# EAGLE schematic Grove Beginner Kit for Arduino (EAGLE 9.5.2)
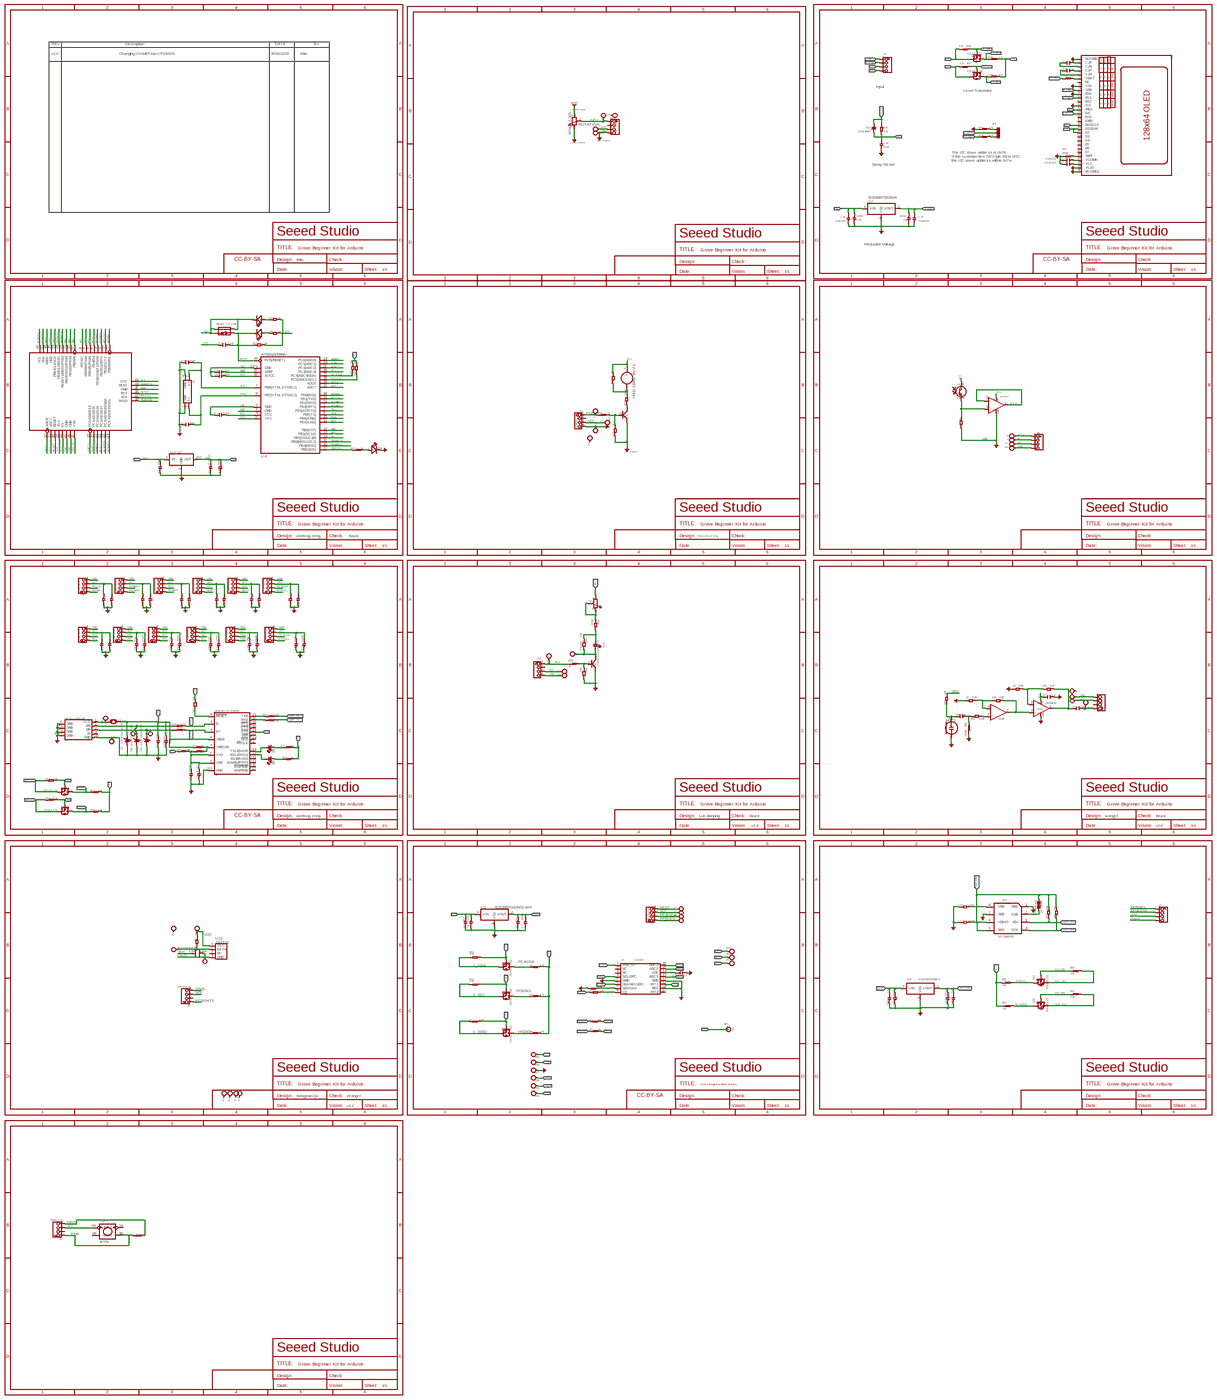
[diagram p0: schematic, sheet 1, overview]
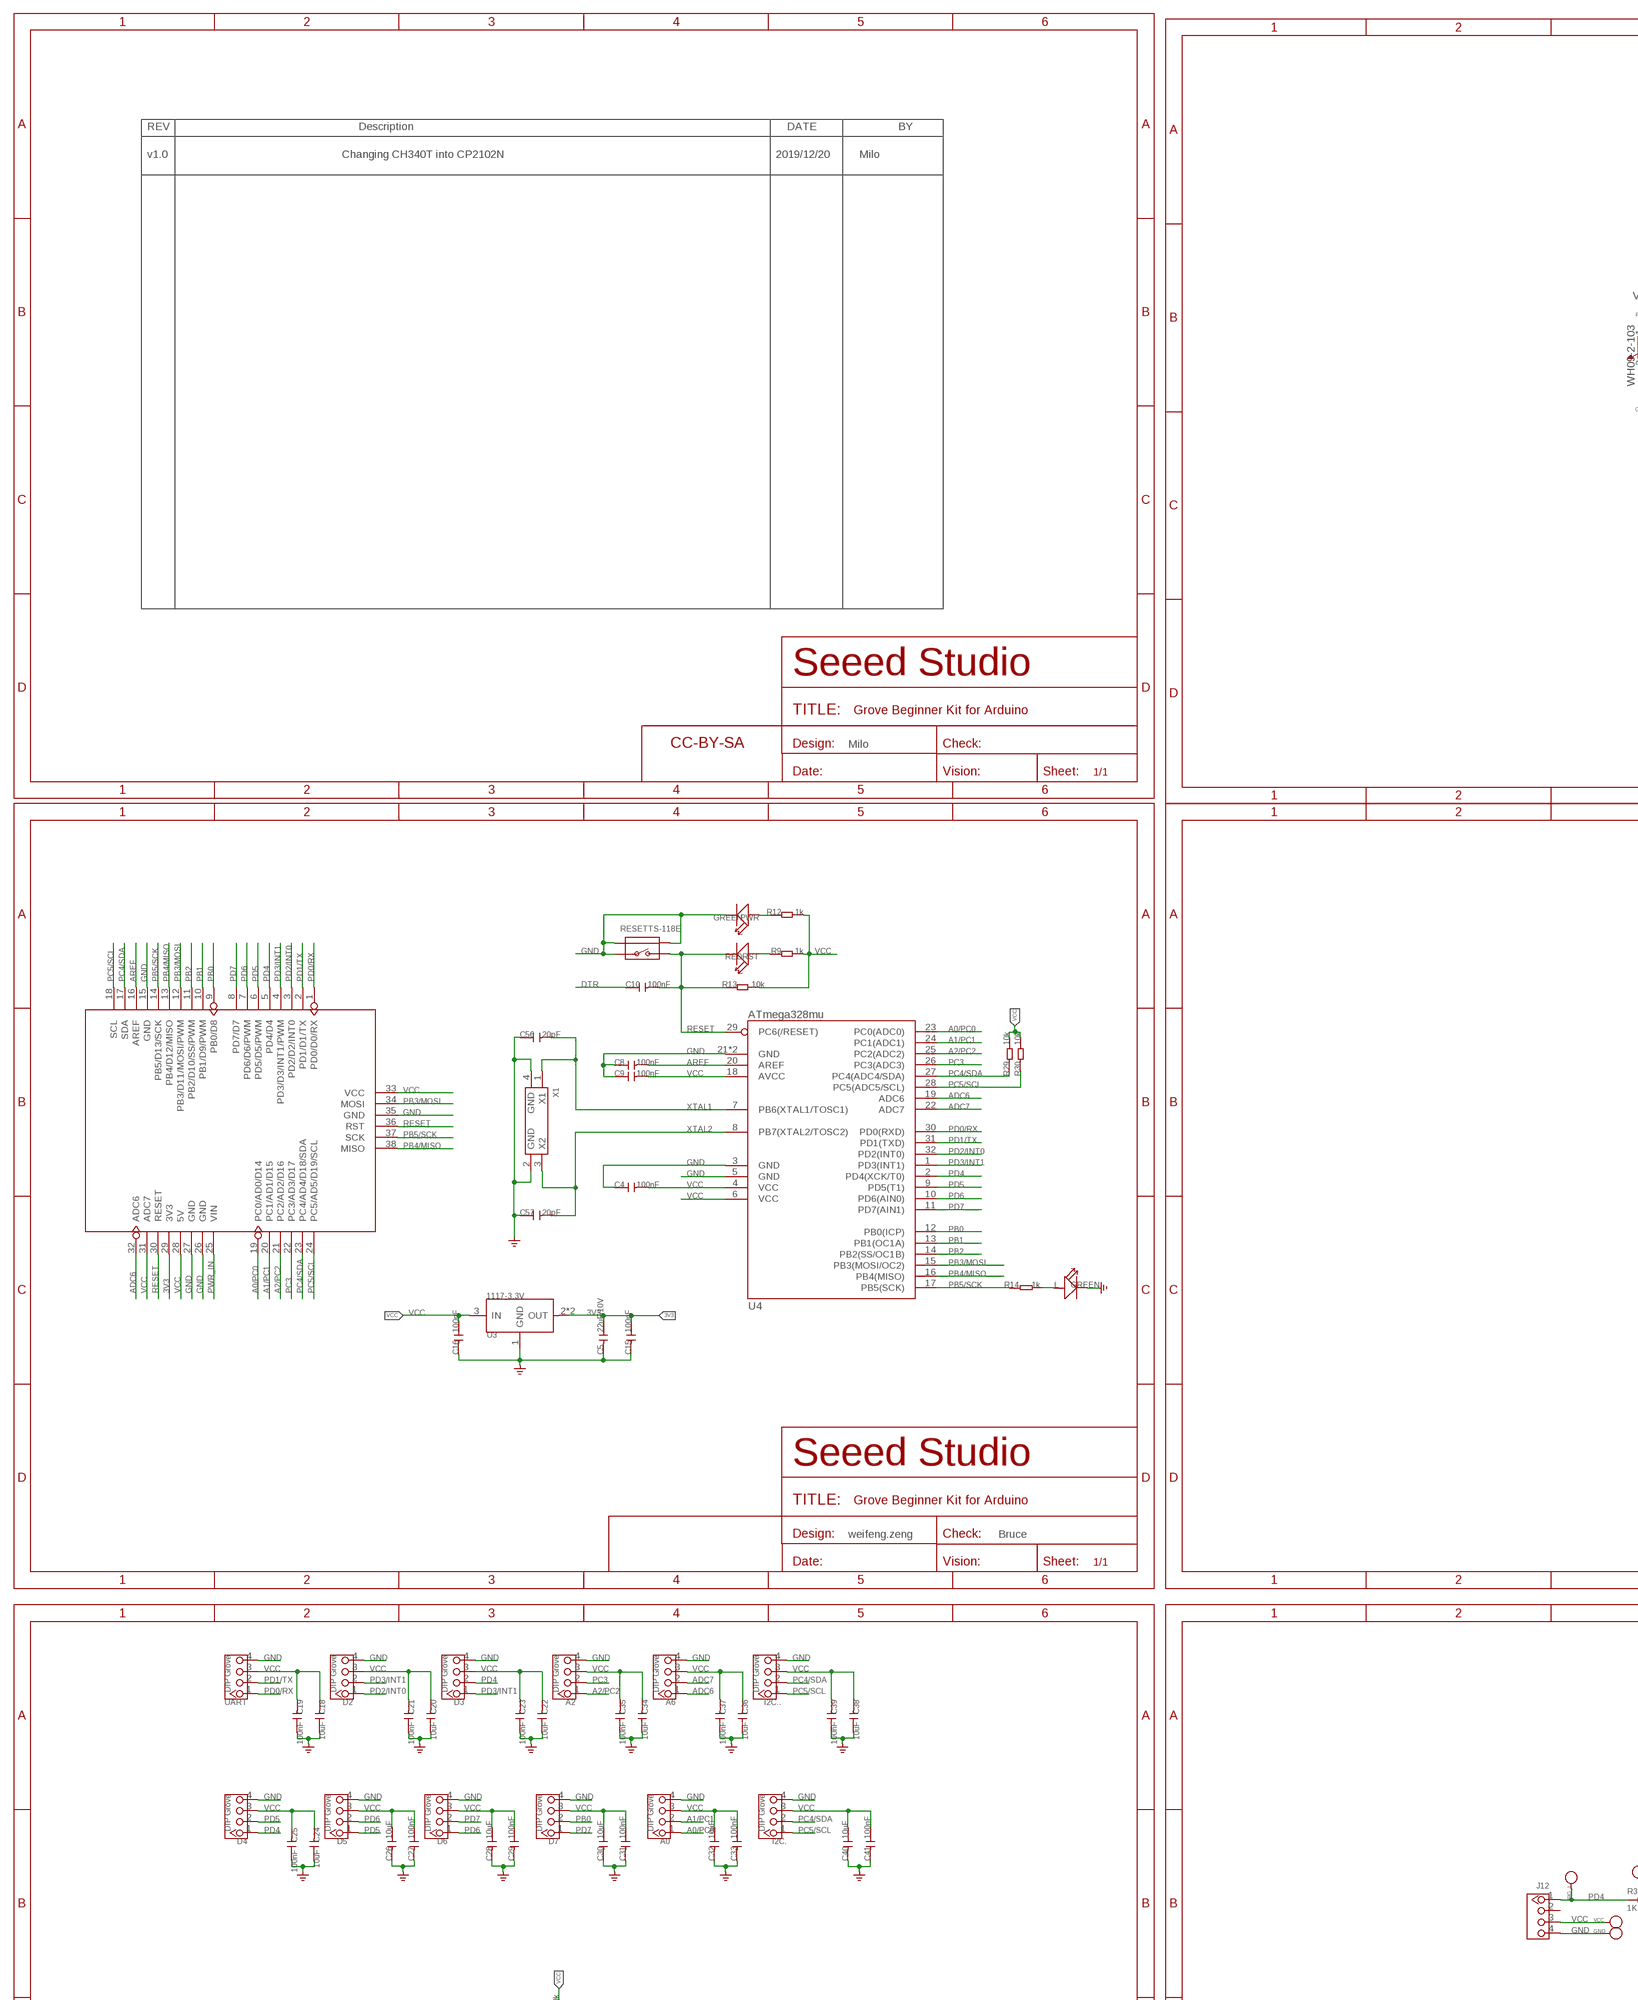
[diagram p1: schematic, sheet 1, part 1 of 4]
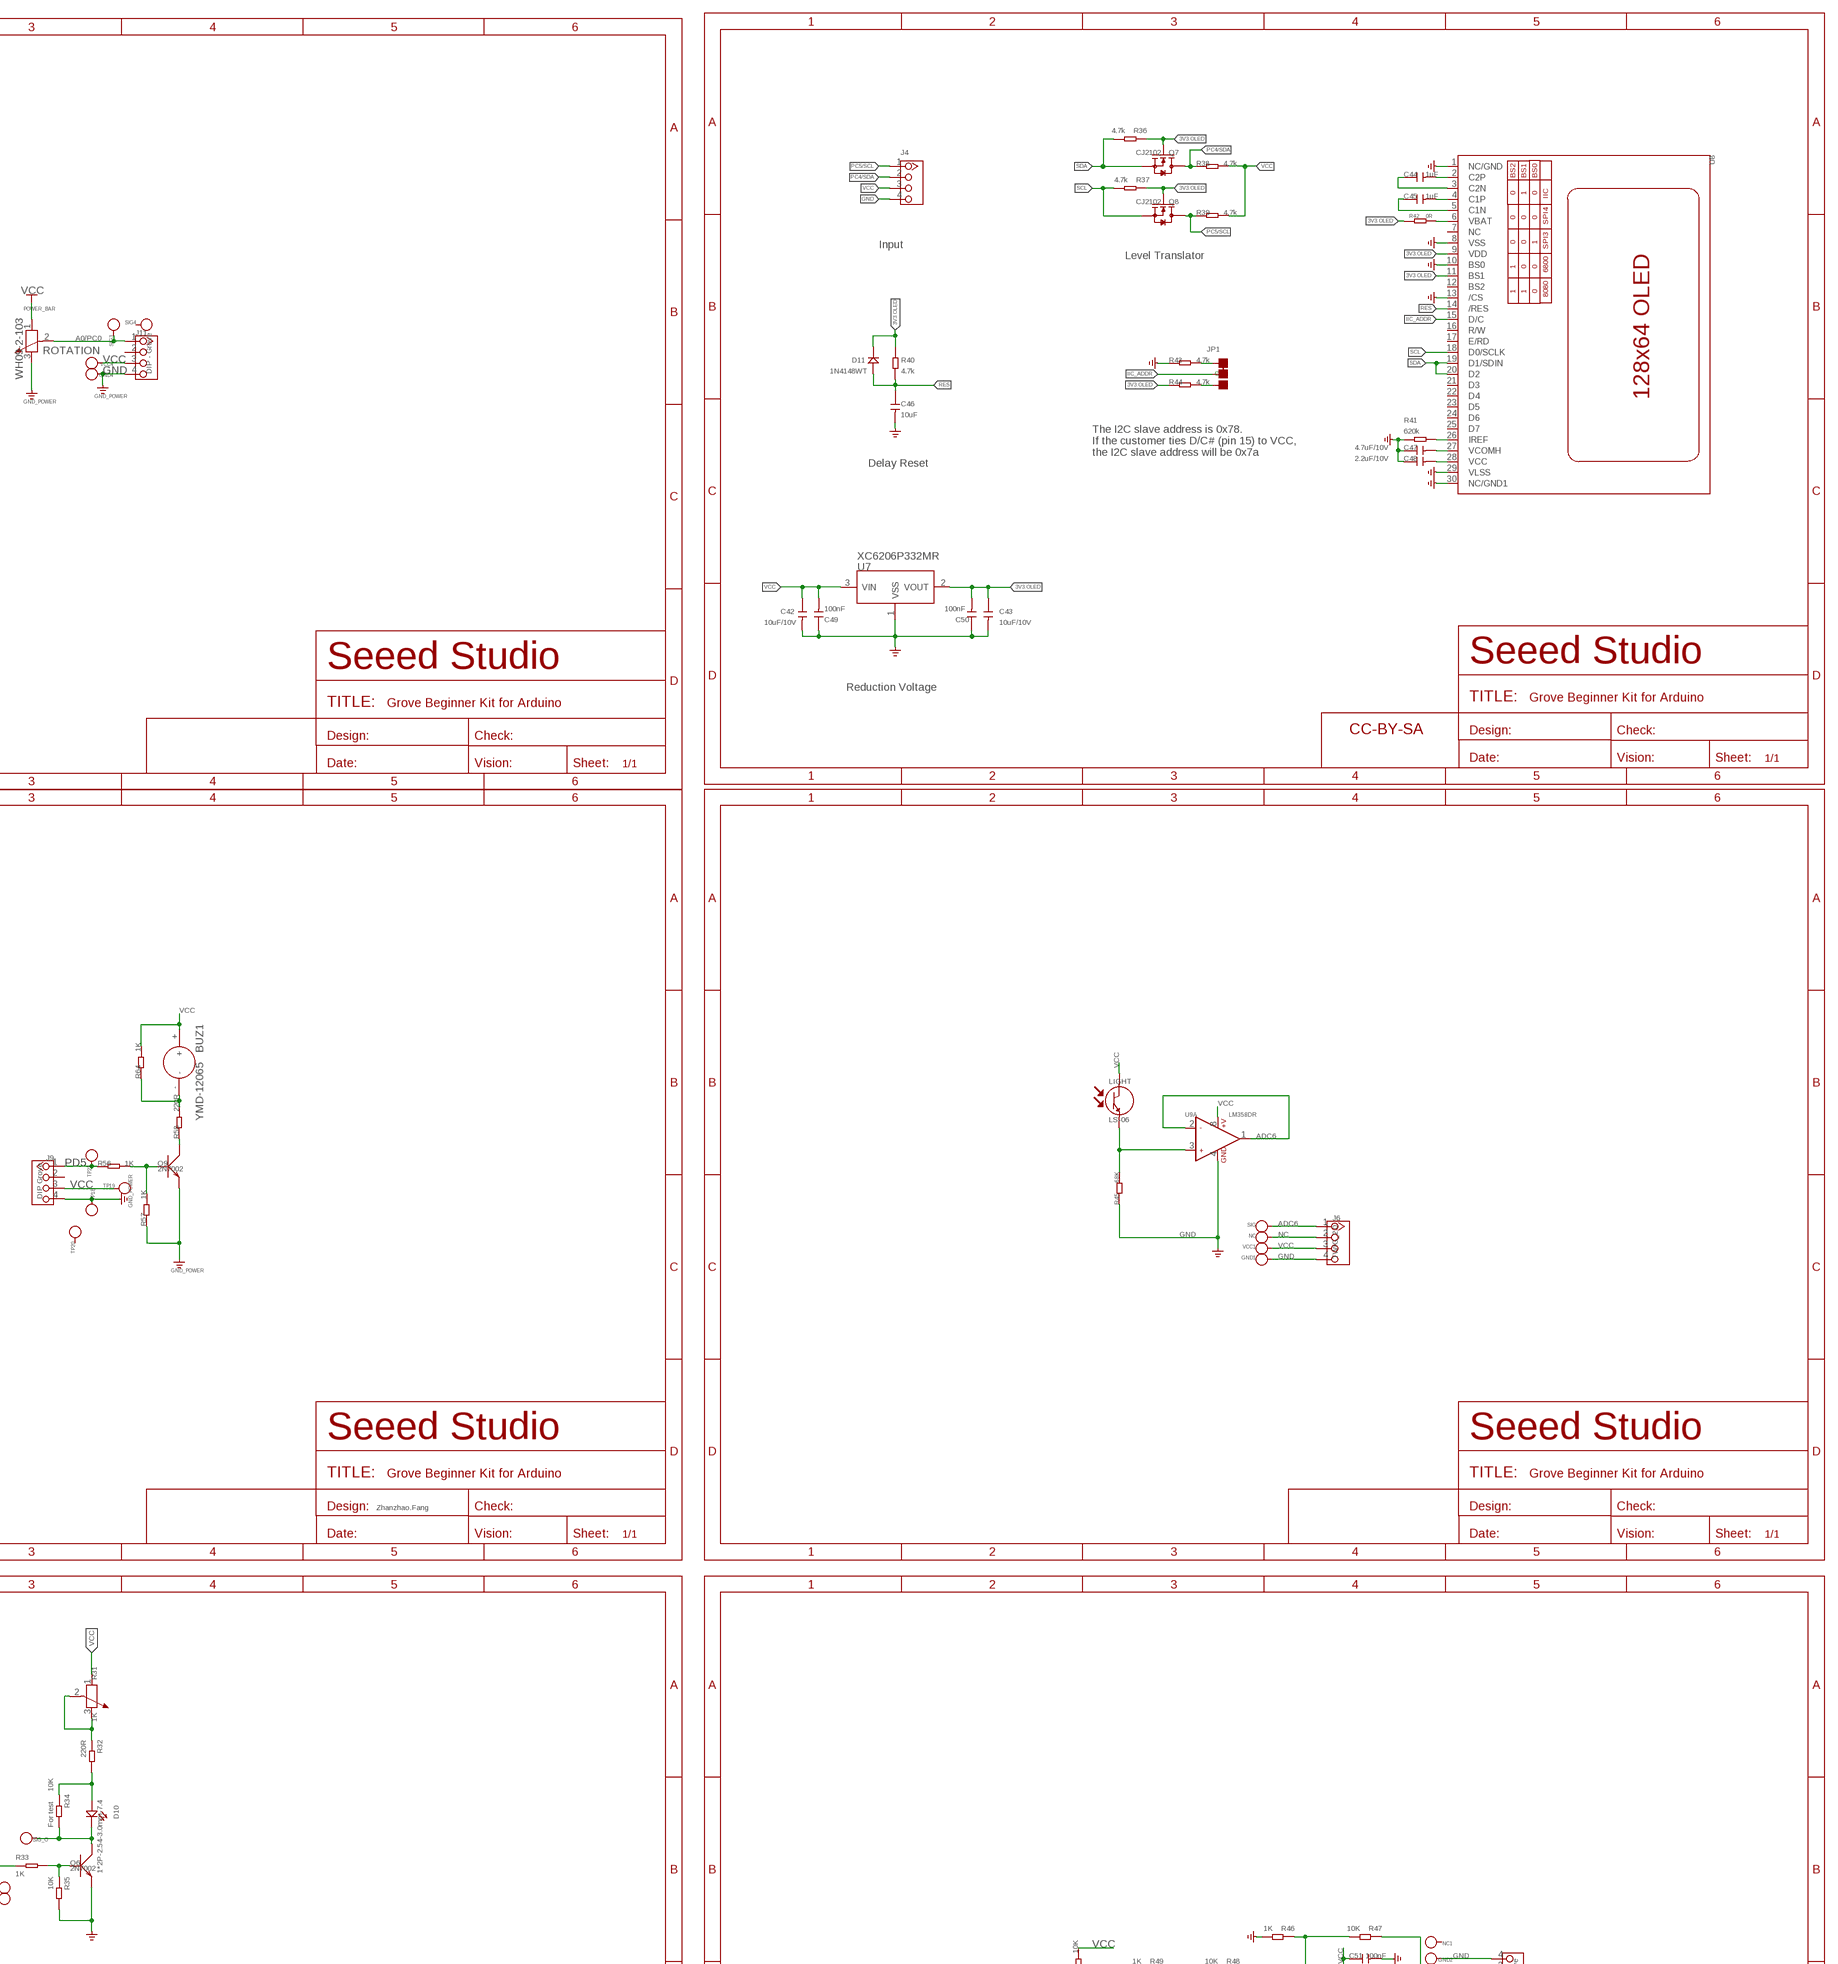
[diagram p2: schematic, sheet 1, part 2 of 4]
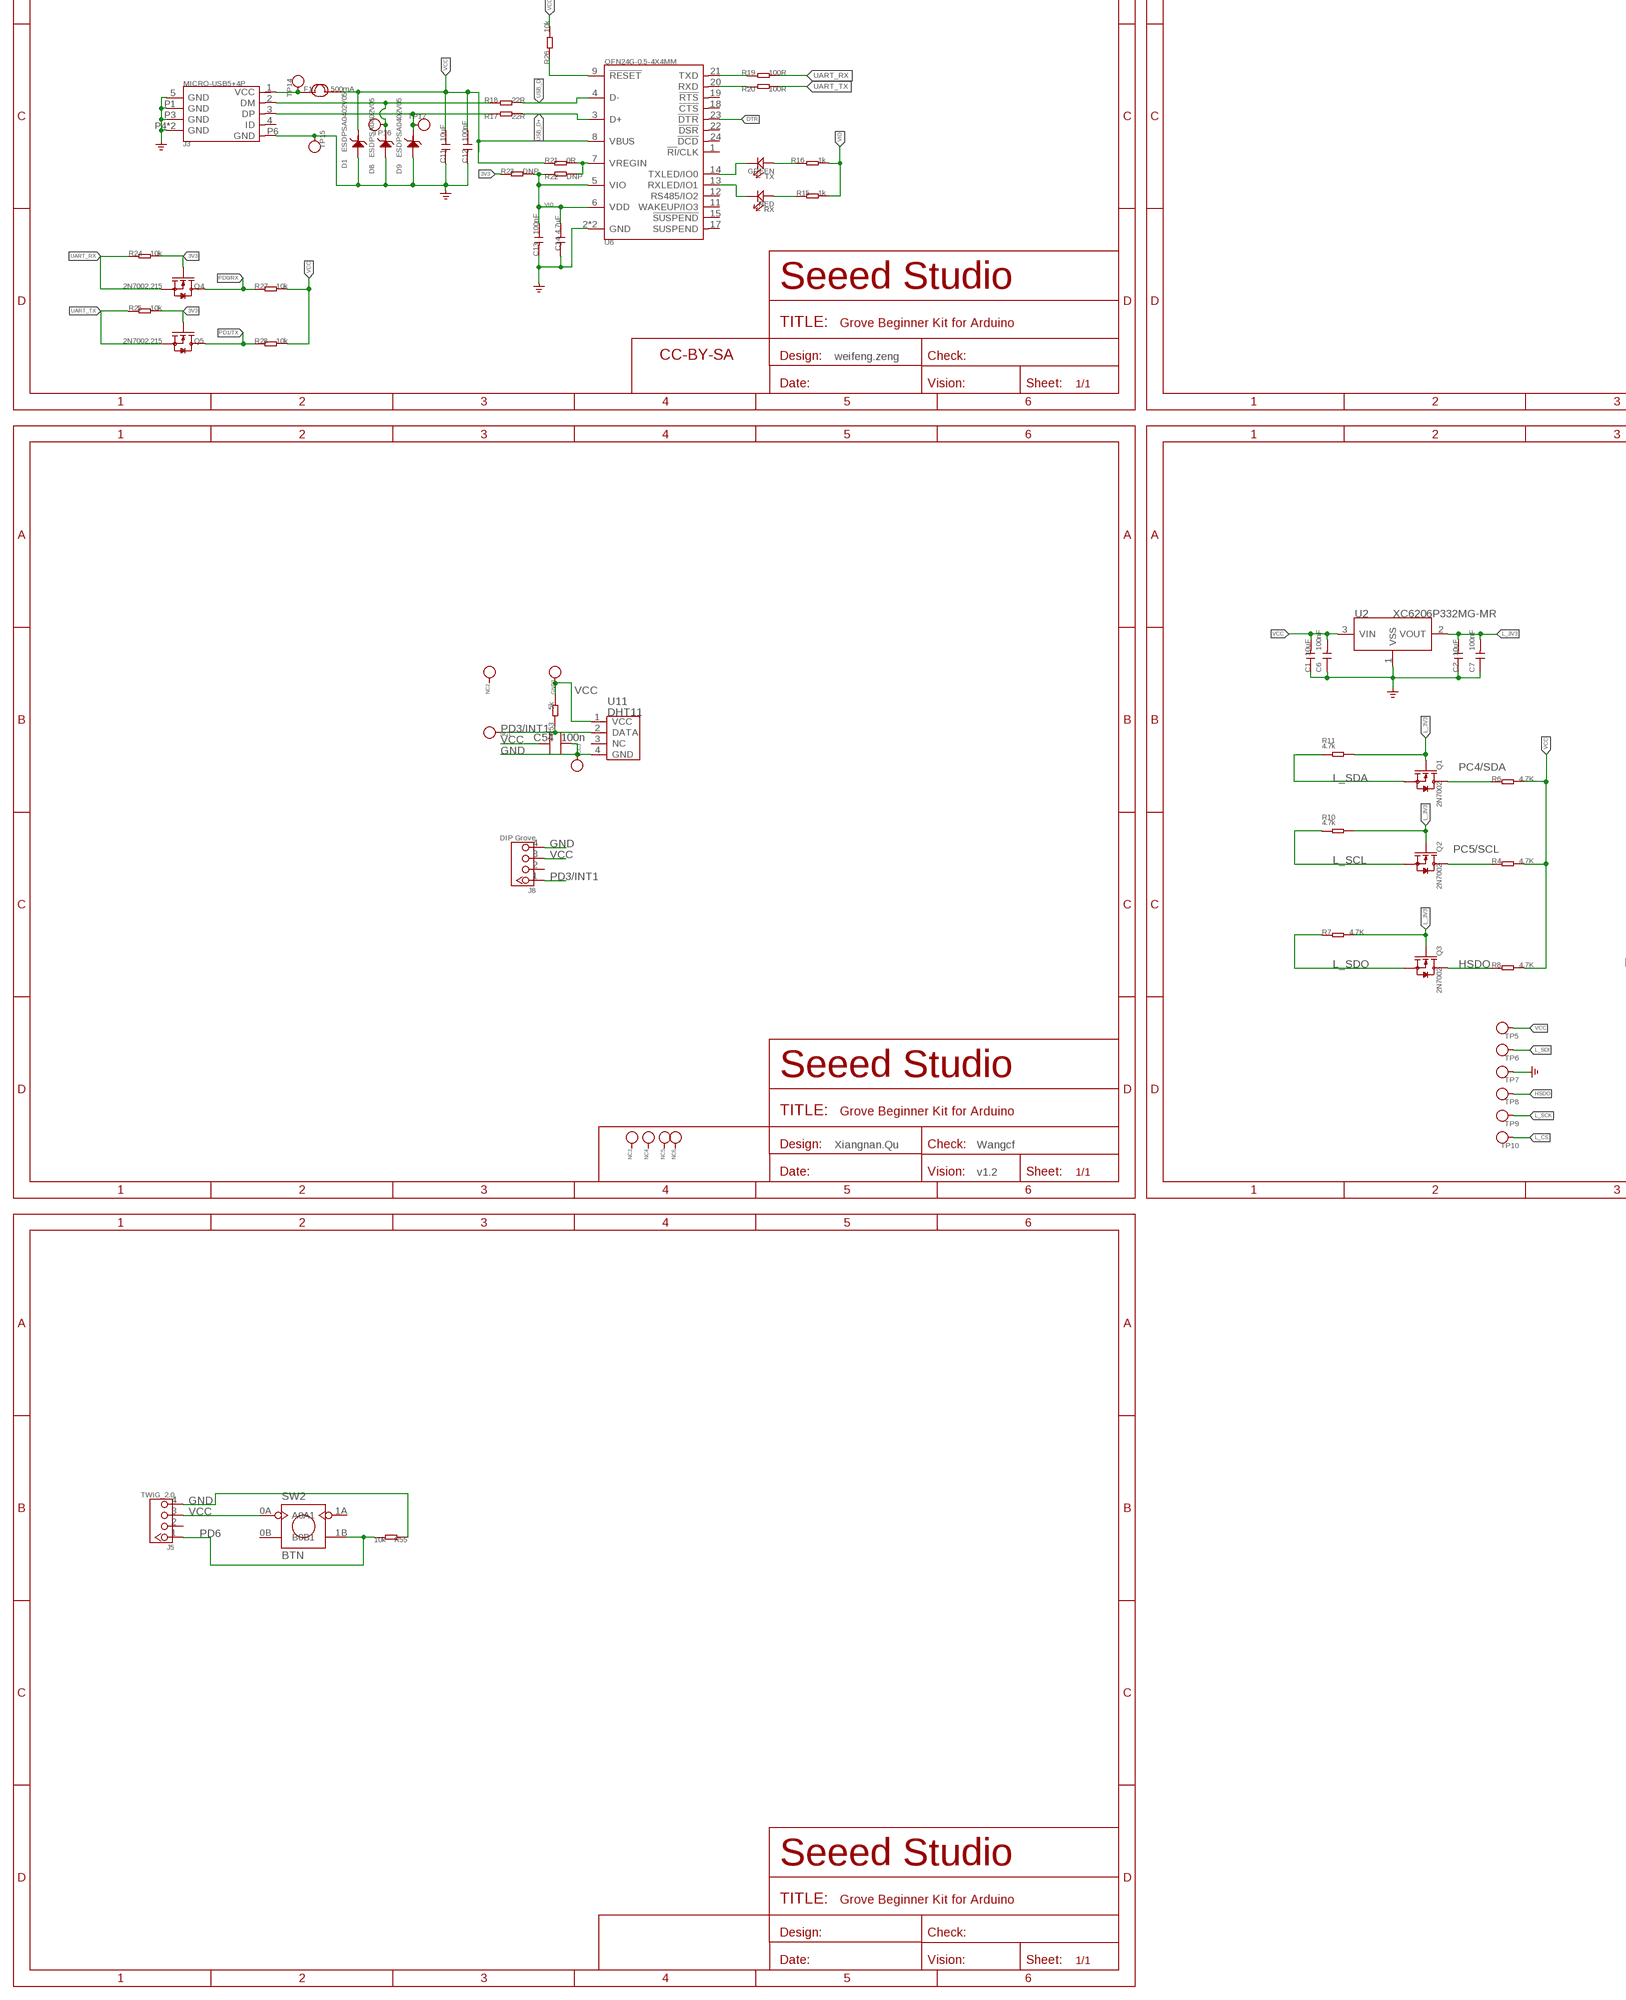
[diagram p3: schematic, sheet 1, part 3 of 4]
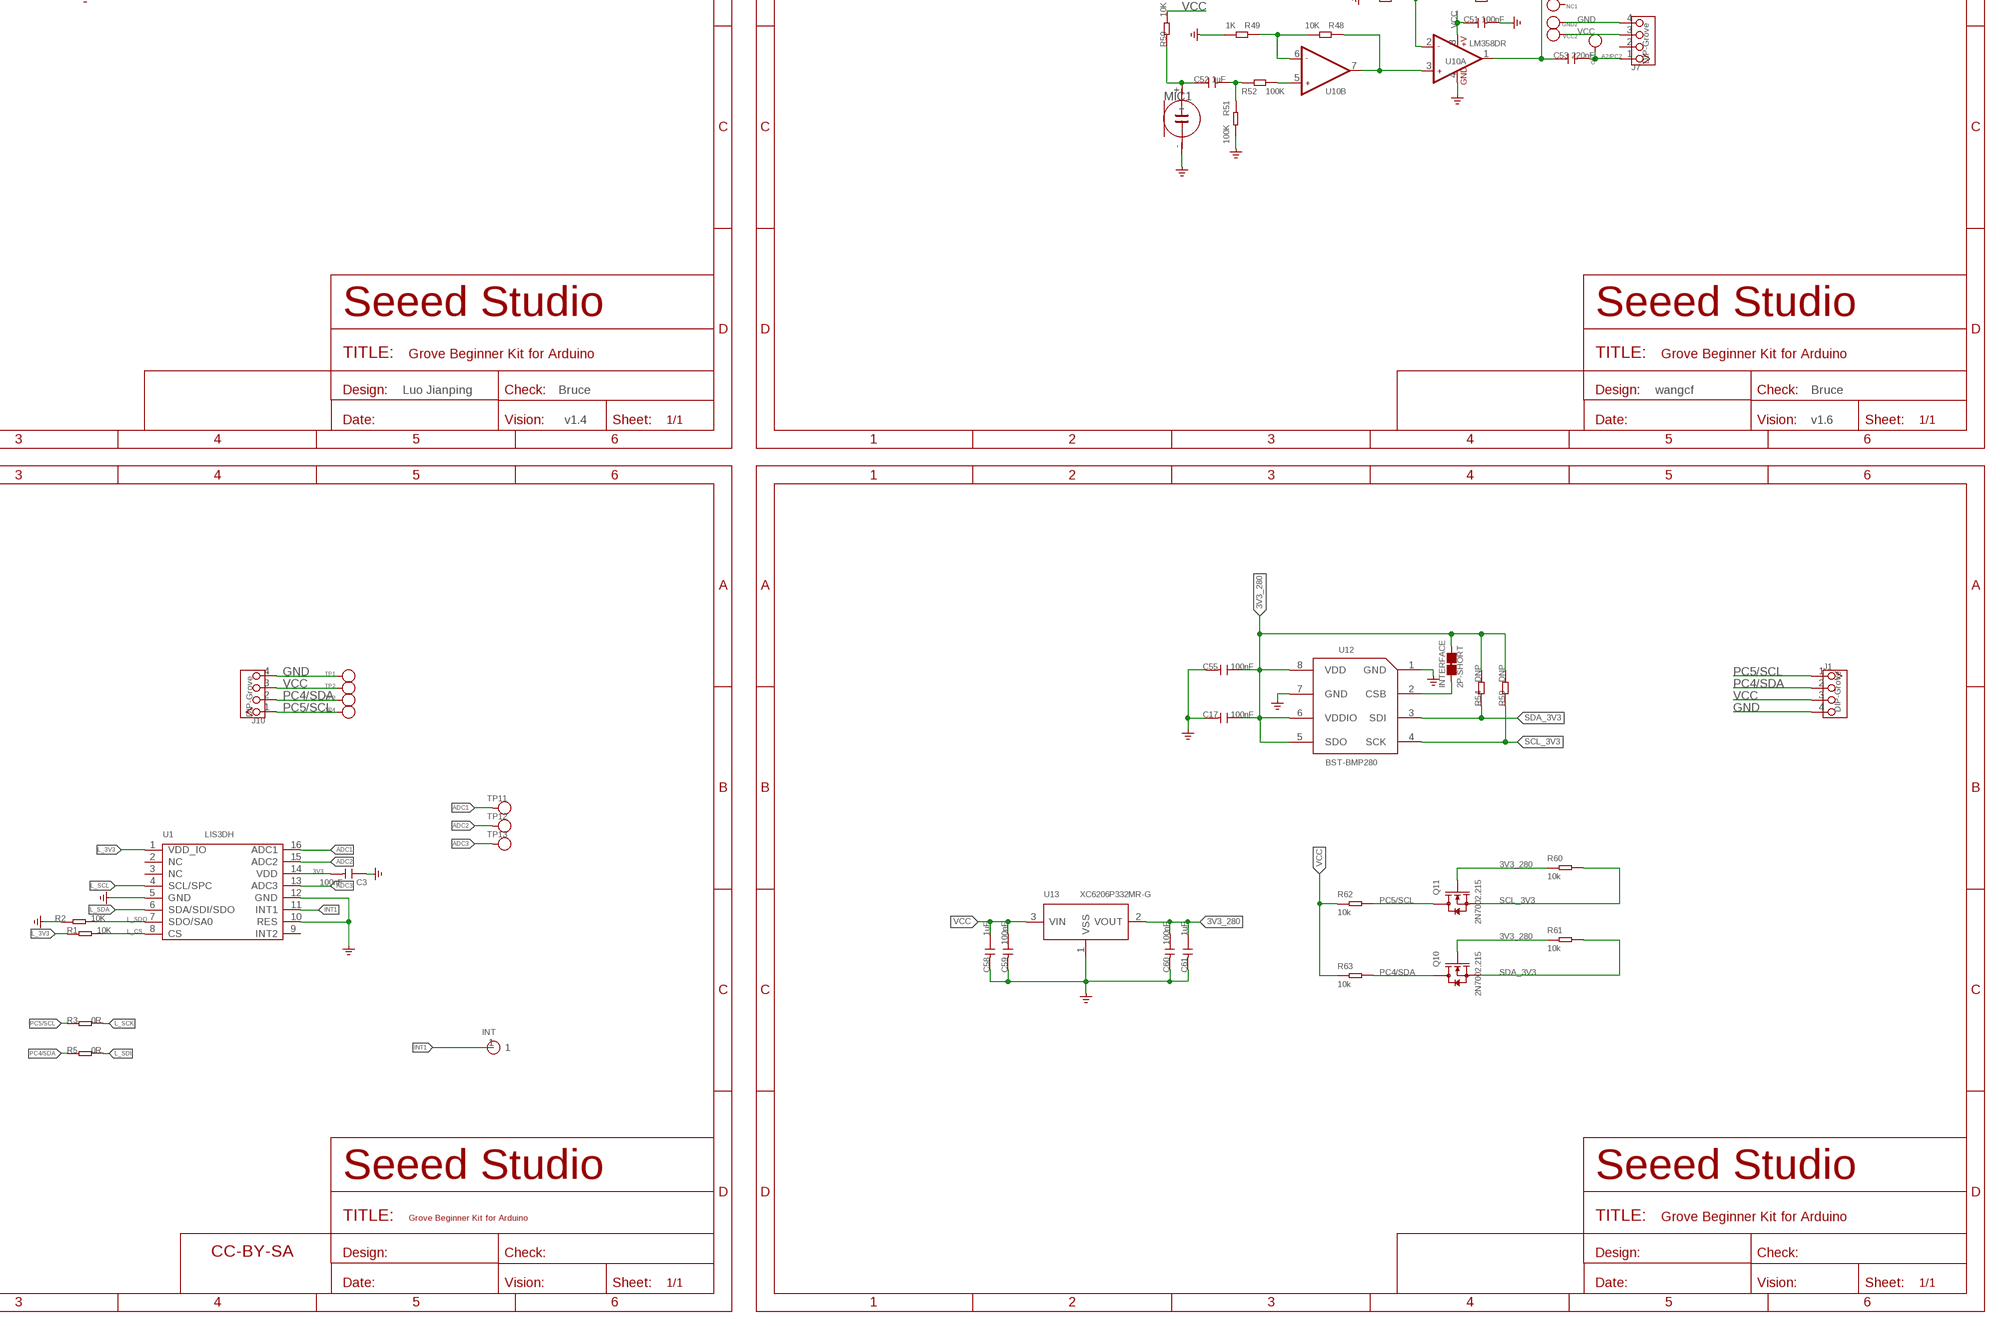
[diagram p4: schematic, sheet 1, part 4 of 4]

## Parts
A0  DIP Grove  TWIG-4P-2.0-2.0  [4P-2.0]
A2  DIP Grove  TWIG-4P-2.0-2.0  [4P-2.0]
A6  DIP Grove  TWIG-4P-2.0-2.0  [4P-2.0]
BUZ1  YMD-12065  BUZZER-YMD12065  [2P-7.6-D12X6.5H]
C1  10uF  C-0603  [C0603]
C2  10uF  C-0603  [C0603]
C3  100nF  CAP-0402  [C0402]
C4  100nF  CAP-0603  [C0603]
C5  22uF/10V  CAP-0603  [C0603]
C6  100nF  CAP-0603  [C0603]
C7  100nF  CAP-0603  [C0603]
C8  100nF  CAP-0603  [C0603]
C9  100nF  CAP-0603  [C0603]
C10  100nF  CAP-0603  [C0603]
C11  10uF  CAP-0603  [C0603]
C12  100nF  CAP-0603  [C0603]
C13  100nF  CAP-0603  [C0603]
C14  4.7uF  CAP-0603  [C0603]
C15  100nF  CAP-0603  [C0603]
C16  100nF  CAP-0603  [C0603]
C17  100nF  CAP-0603  [C0603]
C18  10uF  CAP-0603  [C0603]
C19  100nF  CAP-0603  [C0603]
C20  10uF  CAP-0603  [C0603]
C21  100nF  CAP-0603  [C0603]
C22  10uF  CAP-0603  [C0603]
C23  100nF  CAP-0603  [C0603]
C24  10uF  CAP-0603  [C0603]
C25  100nF  CAP-0603  [C0603]
C26  10uF  CAP-0603  [C0603]
C27  100nF  CAP-0603  [C0603]
C28  10uF  CAP-0603  [C0603]
C29  100nF  CAP-0603  [C0603]
C30  10uF  CAP-0603  [C0603]
C31  100nF  CAP-0603  [C0603]
C32  10uF  CAP-0603  [C0603]
C33  100nF  CAP-0603  [C0603]
C34  10uF  CAP-0603  [C0603]
C35  100nF  CAP-0603  [C0603]
C36  10uF  CAP-0603  [C0603]
C37  100nF  CAP-0603  [C0603]
C38  10uF  CAP-0603  [C0603]
C39  100nF  CAP-0603  [C0603]
C40  10uF  CAP-0603  [C0603]
C41  100nF  CAP-0603  [C0603]
C42  10uF/10V  C-0603  [C0603]
C43  10uF/10V  C-0603  [C0603]
C44  1uF  C-0402  [C0402]
C45  1uF  C-0402  [C0402]
C46  10uF  C-0603  [C0603]
C47  4.7uF/10V  C-0603  [C0603]
C48  2.2uF/10V  C-0603  [C0603]
C49  100nF  C-0402  [C0402]
C50  100nF  C-0402  [C0402]
C51  100nF  C-0603  [C0603]
C52  1uF  C-0603  [C0603]
C53  220nF  C-0603  [C0603]
C54  100n  C0603  [0603]
C55  100nF  CAP-0603  [C0603]
C56  20pF  CAP-0603  [C0603]
C57  20pF  CAP-0603  [C0603]
C58  1uF  CAP-0603  [C0603]
C59  100nF  CAP-0603  [C0603]
C60  100nF  CAP-0603  [C0603]
C61  1uF  CAP-0603  [C0603]
D1  ESDPSA0402V05  D-ESD-2P'DF2S6.8FS'  [SOD-923]
D2  DIP Grove  TWIG-4P-2.0-2.0  [4P-2.0]
D3  DIP Grove  TWIG-4P-2.0-2.0  [4P-2.0]
D4  DIP Grove  TWIG-4P-2.0-2.0  [4P-2.0]
D5  DIP Grove  TWIG-4P-2.0-2.0  [4P-2.0]
D6  DIP Grove  TWIG-4P-2.0-2.0  [4P-2.0]
D7  DIP Grove  TWIG-4P-2.0-2.0  [4P-2.0]
D8  ESDPSA0402V05  D-ESD-2P'DF2S6.8FS'  [SOD-923]
D9  ESDPSA0402V05  D-ESD-2P'DF2S6.8FS'  [SOD-923]
D10  1*2P-2.54-3.0mm-7.4  LED-2.54-6MM  [LED-2P-2.54-6MM]
D11  1N4148WT  DIODE'0603'  [SOD-523]
F1  500mA  FUSE'1206'  [F1206]
FR2  SEEEDSTUDIO-OPEN-SCH-FRAME  [SEEEDSTUDIO-PCB-FRAME]
FR3  SEEEDSTUDIO-OPEN-SCH-FRAME  [SEEEDSTUDIO-PCB-FRAME]
FR4  SEEEDSTUDIO-OPEN-SCH-FRAME  [SEEEDSTUDIO-PCB-FRAME]
FR5  SEEEDSTUDIO-OPEN-SCH-FRAME  [SEEEDSTUDIO-PCB-FRAME]
GND  PAD-TEST-POINT'4545'  [TP_4545]
GND1  TEST-POINT'4545'  [TP-D45MIL]
GND2  PAD-TEST-POINT'4545'  [TP_4545]
GND3  PAD-TEST-POINT'4545'  [TP_4545]
GND4  PAD-TEST-POINT'4545'  [TP_4545]
I2C.  DIP Grove  TWIG-4P-2.0-2.0  [4P-2.0]
I2C..  DIP Grove  TWIG-4P-2.0-2.0  [4P-2.0]
INT  HEADER-1P-35  [1P-65/35MIL]
INTERFACE  2P-SHORT  JUMPER-2P-SHORT  [2P-SMD-SHORT]
J1  DIP-Grove  TWIG-4P-2.0-2.0  [4P-2.0]
J3  MICRO-USB5+4P  [MICRO-USB5+5P-SMD-0.65-7.2X5.06MM]
J4  GROVE-CONNECTOR-DIP-320110033  [HW4-2.0]
J5  TWIG_2.0  [2.0_1X4]
J6  TWIG_2.0  GROVE-CONNECTOR-DIP-320110033  [HW4-2.0]
J7  DIP-Grove  TWIG-4P-2.0-2.0  [4P-2.0]
J8  DIP Grove  TWIG_2.0  [2.0_1X4]
J9  DIP Grove  TWIG-4P-2.0-2.0  [4P-2.0]
J10  DIP-Grove  TWIG-4P-2.0-2.0  [4P-2.0]
J11  DIP - Grove  TWIG-4P-2.0-2.0  [4P-2.0]
J12  GROVE-CONNECTOR-DIP-320110033  [HW4-2.0]
JP1  JP-3P-SHORT  [3P-SMD-SHORT@1]
L  GREEN  LED'0603'  [LED-0603]
LIGHT  LS-06  PHOTISTOR-PT550  [DIP2P-D5MM-2.54]
MIC1  MICROPHONE'KS-9745P,-56DB'  [2P-D9.7/4.5H]
NC  TEST-POINT'4545'  [TP-D45MIL]
NC1  PAD-TEST-POINT'4545'  [TP_4545]
NC2  PAD-TEST-POINT'4545'  [TP_4545]
NC3  PAD-TEST-POINT'4545'  [TP_4545]
NC4  PAD-TEST-POINT'4545'  [TP_4545]
NC5  PAD-TEST-POINT'4545'  [TP_4545]
NC6  PAD-TEST-POINT'4545'  [TP_4545]
OUT  PAD-TEST-POINT'4545'  [TP_4545]
PWR  GREEN  LED'0603'  [LED-0603]
Q1  2N7002  MOSFET-N'SOT23'  [SOT23]
Q2  2N7002  MOSFET-N'SOT23'  [SOT23]
Q3  2N7002  MOSFET-N'SOT23'  [SOT23]
Q4  2N7002,215  MOSFET-N'SOT23'  [SOT-23]
Q5  2N7002,215  MOSFET-N'SOT23'  [SOT-23]
Q6  2N7002  TRANSISTOR-NPN-SOT23  [SOT23]
Q7  CJ2102  MOSFET-N'SI1304BDL'  [SOT-323]
Q8  CJ2102  MOSFET-N'SI1304BDL'  [SOT-323]
Q9  2N7002  TRANSISTOR-NPN-SOT23  [SOT23]
Q10  2N7002,215  MOSFET-N'SOT23'  [SOT-23]
Q11  2N7002,215  MOSFET-N'SOT23'  [SOT-23]
R1  10K  RES-0402  [R0402]
R2  10K  RES-0402  [R0402]
R3  0R  RES-0402  [R0402]
R4  4.7K  R-0402  [R0402]
R5  0R  RES-0402  [R0402]
R6  4.7K  R-0402  [R0402]
R7  4.7K  R-0402  [R0402]
R8  4.7K  R-0402  [R0402]
R9  1k  RES-0603  [R0603]
R10  4.7k  RES-0402  [R0402]
R11  4.7k  RES-0402  [R0402]
R12  1k  RES-0603  [R0603]
R13  10k  RES-0603  [R0603]
R14  1k  RES-0603  [R0603]
R15  1k  RES-0603  [R0603]
R16  1k  RES-0603  [R0603]
R17  22R  RES-0603  [R0603]
R18  22R  RES-0603  [R0603]
R19  100R  RES-0603  [R0603]
R20  100R  RES-0603  [R0603]
R21  0R  RES-0603  [R0603]
R22  DNP  RES-0603  [R0603]
R23  DNP  RES-0603  [R0603]
R24  10k  RES-0603  [R0603]
R25  10k  RES-0603  [R0603]
R26  10k  RES-0603  [R0603]
R27  10k  RES-0603  [R0603]
R28  10k  RES-0603  [R0603]
R29  10k  RES-0603  [R0603]
R30  10k  RES-0603  [R0603]
R31  1K  RES-ADJ'EVN-D8A-A03-B**'  [ADJR3-6.7X6.4MM]
R32  220R  RES-0603  [R0603]
R33  1K  RES-0603  [R0603]
R34  10K  RES-0603  [R0603]
R35  10K  RES-0603  [R0603]
R36  4.7k  R-0402  [R0402]
R37  4.7k  R-0402  [R0402]
R38  4.7k  R-0402  [R0402]
R39  4.7k  R-0402  [R0402]
R40  4.7k  R-0402  [R0402]
R41  620k  R-0402  [R0402]
R42  0R  R-0402  [R0402]
R43  4.7k  R-0402  [R0402]
R44  4.7k  R-0402  [R0402]
R45  68K  RES-0603  [R0603]
R46  1K  R-0603  [R0603]
R47  10K  R-0603  [R0603]
R48  10K  R-0603  [R0603]
R49  1K  R-0603  [R0603]
R50  10K  R-0603  [R0603]
R51  100K  R-0603  [R0603]
R52  100K  R-0603  [R0603]
R53  5k  R0603  [0603]
R54  DNP  RES-0603  [R0603]
R55  10k  005-R0603  [0603]
R56  1K  R-0603  [R0603]
R57  1K  R-0603  [R0603]
R58  220R  R-0603  [R0603]
R59  DNP  RES-0603  [R0603]
R60  10k  RES-0603  [R0603]
R61  10k  RES-0603  [R0603]
R62  10k  RES-0603  [R0603]
R63  10k  RES-0603  [R0603]
R64  1K  R-0603  [R0603]
RESET  TS-118E  BUTTON-4P-REINFORCE'TS-1188E'  [4P-SMD-7X3.5X3.5H]
ROTATION  WH09-2-103  R-POTENTIOMETER'WH09-2'  [3P-SQUA-11X9.8X12H]
RST  RED  LED'0603'  [LED-0603]
RX  RED  LED'0603'  [LED-0603]
SIG  TEST-POINT'4545'  [TP-D45MIL]
SIG1  PAD-TEST-POINT'4545'  [TP_4545]
SIG3  PAD-TEST-POINT'4545'  [TP_4545]
SIG4  PAD-TEST-POINT'4545'  [TP_4545]
SIG_I  PAD-TEST-POINT'4545'  [TP_4545]
SIG_O  PAD-TEST-POINT'4545'  [TP_4545]
SW2  BTN  [BTN_8X8]
TP1  PAD-TEST-POINT'4545'  [TP_4545]
TP2  PAD-TEST-POINT'4545'  [TP_4545]
TP3  PAD-TEST-POINT'4545'  [TP_4545]
TP4  PAD-TEST-POINT'4545'  [TP_4545]
TP5  TEST-POINT'4545'  [TP-D45MIL]
TP6  TEST-POINT'4545'  [TP-D45MIL]
TP7  TEST-POINT'4545'  [TP-D45MIL]
TP8  TEST-POINT'4545'  [TP-D45MIL]
TP9  TEST-POINT'4545'  [TP-D45MIL]
TP10  TEST-POINT'4545'  [TP-D45MIL]
TP11  TEST-POINT'4545'  [TP-D45MIL]
TP12  TEST-POINT'4545'  [TP-D45MIL]
TP13  TEST-POINT'4545'  [TP-D45MIL]
TP14  TEST-POINT'4545'  [TP-D45MIL]
TP15  TEST-POINT'4545'  [TP-D45MIL]
TP16  TEST-POINT'4545'  [TP-D45MIL]
TP17  TEST-POINT'4545'  [TP-D45MIL]
TP18  PAD-TEST-POINT'4545'  [TP_4545]
TP19  PAD-TEST-POINT'4545'  [TP_4545]
TP20  PAD-TEST-POINT'4545'  [TP_4545]
TP21  PAD-TEST-POINT'4545'  [TP_4545]
TX  GREEN  LED'0603'  [LED-0603]
U1  LIS3DH  SENSOR-MOTION/POSITION-LIS3DH-314080105  [LGA16-0.5-3X3MM]
U2  XC6206P332MG-MR  XC6206MR  [SOT23]
U3  1117-3.3V  LD1117'SOT89'  [SOT89]
U4  ATmega328mu  ATMEGA8/168/328MLF  [MLF32X-W/HEAT]
U5  ARDUINO-38P  [ARDUINO-38P]
U6  QFN24G-0.5-4X4MM  CONVERTER-CP2102N(QFN24)  [QFN24G-0.5-4X4MM]
U7  XC6206P332MR  PMIC-XC6206PMR  [SOT-23]
U8  OLED-12864-30P  [OLED30P-0.7-24.74X16.9MM]
U9  LM358DR  AMPLIFIER-LMV358'D'  [SOIC8-1.27-5X4MM]
U10  LM358DR  LMV358D  [SO08]
U11  DHT11  SENSOR-DHT11  [DHT11]
U12  BST-BMP280  SENSOR-BMP280  [LGA8-0.65-2X2.5X0.95MM]
U13  XC6206P332MR-G  PMIC-XC6206PMR  [SOT-23]
UART  DIP Grove  TWIG-4P-2.0-2.0  [4P-2.0]
VCC  PAD-TEST-POINT'4545'  [TP_4545]
VCC1  TEST-POINT'4545'  [TP-D45MIL]
VCC2  PAD-TEST-POINT'4545'  [TP_4545]
VCC3  PAD-TEST-POINT'4545'  [TP_4545]
VCC4  PAD-TEST-POINT'4545'  [TP_4545]
X1  CRYSTAL-4P-3225  [X4-SMD-3.2X2.5X0.7MM]

## Nets
3V3: C3.2 C5.1 C15.1 Q4.1(G) Q5.1(G) R23.1 R24.2 R25.2 U1.14(VDD) U3.2(OUT) U3.4(OUT) U5.29(3V3)
3V3.OLED: C43.1 C50.2 D11.- Q7.1(G) Q8.1(G) R36.1 R37.2 R40.2 R42.1 R44.1 U7.2(VOUT) U8.9(VDD) U8.11(BS1)
3V3_280: C17.1 C55.1 C60.1 C61.1 INTERFACE.2 Q10.1(G) Q11.1(G) R54.2 R59.2 R60.1 R61.1 U12.5(SDO) U12.6(VDDIO) U12.8(VDD) U13.2(VOUT)
A0/PC0: A0.1 J11.1 ROTATION.2 SIG3.T U4.23(PC0(ADC0)) U5.19(PC0/AD0/D14)
A1/PC1: A0.2 U4.24(PC1(ADC1)) U5.20(PC1/AD1/D15)
A2/PC2: A2.1 C53.2 J7.1 OUT.T U4.25(PC2(ADC2)) U5.21(PC2/AD2/D16)
ADC1: TP11.T U1.16(ADC1)
ADC2: TP12.T U1.15(ADC2)
ADC3: TP13.T U1.13(ADC3)
ADC6: A6.1 J6.1 SIG.T U4.19(ADC6) U5.32(ADC6) U9.1(A:OUT1) U9.2(A:-IN1)
ADC7: A6.2 U4.22(ADC7)
AREF: C8.2 U4.20(AREF) U5.16(AREF)
CS: INTERFACE.1 U12.2(CSB)
D-: D8.1 J3.2(DM) R18.1 TP16.T
DTR: C10.1 U6.23(!DTR!)
GND: A0.4 A2.4 A6.4 C1.1 C2.1 C3.1 C4.1 C5.2 C6.1 C7.1 C8.1 C9.1 C11.2 C12.2 C13.2 C14.2 C15.2 C16.2 C17.2 C18.1 C19.1 C20.1 C21.1 C22.1 C23.1 C24.1 C25.1 C26.2 C27.2 C28.2 C29.2 C30.2 C31.2 C32.2 C33.2 C34.1 C35.1 C36.1 C37.1 C38.1 C39.1 C40.2 C41.2 C42.2 C43.2 C46.2 C47.1 C48.1 C49.1 C50.1 C51.2 C54.2 C55.2 C56.1 C57.1 C58.2 C59.2 C60.2 C61.2 D1.2 D2.4 D3.4 D4.4 D5.4 D6.4 D7.4 D8.2 D9.2 GND1.T GND2.T GND4.T GND.T I2C..4 I2C...4 J1.4 J3.5(GND) J3.P1(GND) J3.P3(GND) J3.P4(GND) J3.P5(GND) J3.P6(GND) J4.4 J5.4 J6.4 J7.4 J8.4 J9.4 J10.4 J11.4 J12.4 L.- MIC1.- PWR.- Q6.2(E) Q9.2(E) R2.1 R35.2 R41.2 R43.1 R45.1 R46.2 R49.2 R51.2 R55.1 R57.1 RESET.1 RESET.S1 RESET.S2 ROTATION.3 TP1.T TP7.T TP15.T TP18.T U1.5(GND) U1.10(RES) U1.12(GND) U2.1(VSS) U3.1(GND) U4.3(GND) U4.5(GND) U4.21(GND) U4.HEAT(GND) U5.15(GND) U5.26(GND) U5.27(GND) U5.35(GND) U6.2(GND) U6.PAD(GND) U7.1(VSS) U8.1(NC/GND) U8.8(VSS) U8.10(BS0) U8.13(/CS) U8.29(VLSS) U8.30(NC/GND1) U9.4(A:GND) U10.4(A:GND) U11.4(GND) U12.1(GND) U12.7(GND) U13.1(VSS) UART.4 VCC3.T X1.2(GND) X1.4(GND) ; supply symbol labelled GND_POWER
HSDO: Q3.3(D) R8.1 TP8.T
IIC_ADDR: JP1.MM(C) U8.15(D/C)
INT1: INT.1 U1.11(INT1)
L_3V3: C2.2 C7.2 Q1.1(G) Q2.1(G) Q3.1(G) R1.1 R7.2 R10.2 R11.2 U1.1(VDD_IO) U2.2(VOUT)
L_CS: R1.2 TP10.T U1.8(CS)
L_SCK: R3.2 TP9.T
L_SCL: Q2.2(S) R10.1 U1.4(SCL/SPC)
L_SDA: Q1.2(S) R11.1 U1.6(SDA/SDI/SDO)
L_SDI: R5.2 TP6.T
L_SDO: Q3.2(S) R2.2 R7.1 U1.7(SDO/SA0)
N$1: R21.2 R22.2 U6.7(VREGIN)
N$2: R9.2 RST.+
N$3: PWR.+ R12.2
N$4: R26.2 U6.9(!RESET!)
N$5: TX.- U6.14(TXLED/IO0)
N$6: R31.2 R31.3 R32.1
N$7: F1.1 J3.1(VCC) TP14.T
N$8: D10.+ R32.2 R34.1
N$9: D10.- Q6.3(C) R34.2 SIG_O.T
N$10: RX.- U6.13(RXLED/IO1)
N$11: D9.1 J3.3(DP) R17.1 TP17.T
N$12: Q6.1(B) R33.2 R35.1
N$13: L.+ R14.2
N$14: Q9.1(B) R56.2 R57.2
N$15: C44.2 U8.2(C2P)
N$16: C45.2 U8.4(C1P)
N$17: R20.1 U6.20(RXD)
N$18: R19.1 U6.21(TXD)
N$19: C44.1 U8.3(C2N)
N$20: C45.1 U8.5(C1N)
N$21: R41.1 U8.26(IREF)
N$22: C47.2 U8.27(VCOMH)
N$23: C48.2 U8.28(VCC)
N$24: R42.2 U8.6(VBAT)
N$25: JP1.11(L) R43.2
N$26: JP1.00(R) R44.2
N$27: BUZ1.- R58.2 R64.1
N$28: LIGHT.E R45.2 U9.3(A:+IN1)
N$29: R46.1 R47.2 U10.2(A:-IN1)
N$30: R48.1 U10.3(A:+IN1) U10.7(B:OUT2)
N$31: C52.1 MIC1.+ R50.1
N$32: R48.2 R49.1 U10.6(B:-IN2)
N$33: R52.2 U10.5(B:+IN2)
N$34: C52.2 R51.1 R52.1
N$36: R15.1 RX.+
N$37: R16.1 TX.+
N$66: Q9.3(C) R58.1
NC: J6.2 NC.T
OUT1: C53.1 R47.1 U10.1(A:OUT1)
PB0: D7.2 U4.12(PB0(ICP)) U5.9(PB0/D8)
PB1: U4.13(PB1(OC1A)) U5.10(PB1/D9/PWM)
PB2: U4.14(PB2(SS/OC1B)) U5.11(PB2/D10/SS/PWM)
PB3/MOSI: U4.15(PB3(MOSI/OC2)) U5.12(PB3/D11/MOSI/PWM) U5.34(MOSI)
PB4/MISO: U4.16(PB4(MISO)) U5.13(PB4/D12/MISO) U5.38(MISO)
PB5/SCK: R14.1 U4.17(PB5(SCK)) U5.14(PB5/D13/SCK) U5.37(SCK)
PC3: A2.2 U4.26(PC3(ADC3)) U5.22(PC3/AD3/D17)
PC4/SDA: I2C..2 I2C...2 J1.2 J4.2 J10.2 Q1.3(D) Q7.3(D) Q10.3(D) R5.1 R6.1 R29.2 R38.1 R63.2 TP3.T U4.27(PC4(ADC4/SDA)) U5.17(SDA) U5.23(PC4/AD4/D18/SDA)
PC5/SCL: I2C..1 I2C...1 J1.1 J4.1 J10.1 Q2.3(D) Q8.3(D) Q11.3(D) R3.1 R4.1 R30.2 R39.1 R62.2 TP4.T U4.28(PC5(ADC5/SCL)) U5.18(SCL) U5.24(PC5/AD5/D19/SCL)
PD0/RX: Q4.3(D) R27.1 U4.30(PD0(RXD)) U5.1(PD0/D0/RX) UART.1
PD1/TX: Q5.3(D) R28.1 U4.31(PD1(TXD)) U5.2(PD1/D1/TX) UART.2
PD2/INT0: D2.1 U4.32(PD2(INT0)) U5.3(PD2/D2/INT0)
PD3/INT1: D2.2 D3.1 J8.1 R53.1 SIG1.T U4.1(PD3(INT1)) U5.4(PD3/D3/INT1/PWM) U11.2(DATA)
PD4: D3.2 D4.1 J12.1 R33.1 SIG_I.T U4.2(PD4(XCK/T0)) U5.5(PD4/D4)
PD5: D4.2 D5.1 J9.1 R56.1 TP21.T U4.9(PD5(T1)) U5.6(PD5/D5/PWM)
PD6: D5.2 D6.1 J5.1 R55.2 SW2.1B(B1) U4.10(PD6(AIN0)) U5.7(PD6/D6/PWM)
PD7: D6.2 D7.1 U4.11(PD7(AIN1)) U5.8(PD7/D7)
PWR_IN: U5.25(VIN)
RES: C46.1 D11.+ R40.1 U8.14(/RES)
RESET: C10.2 R13.2 RESET.2 RST.- U4.29(PC6(/RESET)) U5.30(RESET) U5.36(RST)
SCL: Q8.2(S) R37.1 U8.18(D0/SCLK)
SCL_3V3: Q11.2(S) R59.1 R60.2 U12.4(SCK)
SDA: Q7.2(S) R36.2 U8.19(D1/SDIN) U8.20(D2)
SDA_3V3: Q10.2(S) R54.1 R61.2 U12.3(SDI)
UART_RX: Q4.2(S) R19.2 R24.1
UART_TX: Q5.2(S) R20.2 R25.1
USB_D: R18.2 U6.4(D-)
USB_D+: R17.2 U6.3(D+)
VCC: A0.3 A2.3 A6.3 BUZ1.+ C1.2 C4.2 C6.2 C9.2 C11.1 C12.1 C16.1 C18.2 C19.2 C20.2 C21.2 C22.2 C23.2 C24.2 C25.2 C26.1 C27.1 C28.1 C29.1 C30.1 C31.1 C32.1 C33.1 C34.2 C35.2 C36.2 C37.2 C38.2 C39.2 C40.1 C41.1 C42.1 C49.2 C51.1 C54.1 C58.1 C59.1 D1.1 D2.3 D3.3 D4.3 D5.3 D6.3 D7.3 F1.2 GND3.T I2C..3 I2C...3 J1.3 J4.3 J5.3 J6.3 J7.3 J8.3 J9.3 J10.3 J11.3 J12.3 LIGHT.C R4.2 R6.2 R8.2 R9.1 R12.1 R13.1 R21.1 R26.1 R27.2 R28.2 R29.1 R30.1 R31.1 R38.2 R39.2 R50.2 R53.2 R62.1 R63.1 R64.2 ROTATION.1 SW2.0A(A0) TP2.T TP5.T TP19.T U2.3(VIN) U3.3(IN) U4.4(VCC) U4.6(VCC) U4.18(AVCC) U5.28(5V) U5.31(ADC7) U5.33(VCC) U6.8(VBUS) U7.3(VIN) U9.8(A:+V) U10.8(A:+V) U11.1(VCC) U13.3(VIN) UART.3 VCC1.T VCC2.T VCC4.T VCC.T ; supply symbol labelled POWER_BAR
VIO: C13.1 C14.1 R15.2 R16.2 R22.1 R23.2 U6.5(VIO) U6.6(VDD)
XTAL1: C56.2 U4.7(PB6(XTAL1/TOSC1)) X1.1(X1)
XTAL2: C57.2 U4.8(PB7(XTAL2/TOSC2)) X1.3(X2)
Unconnected: J3.4(ID) J5.2 J7.2 J8.2 J9.2 J11.2 J12.2 NC1.T NC2.T NC3.T NC4.T NC5.T NC6.T SIG4.T SW2.0B(B0) SW2.1A(A1) TP20.T U1.2(NC) U1.3(NC) U1.9(INT2) U6.1(!RI!/CLK) U6.11(WAKEUP/IO3) U6.12(RS485/IO2) U6.15(!SUSPEND!) U6.17(SUSPEND) U6.18(!CTS!) U6.19(!RTS!) U6.22(!DSR!) U6.24(!DCD!) U8.7(NC) U8.12(BS2) U8.16(R/W) U8.17(E/RD) U8.21(D3) U8.22(D4) U8.23(D5) U8.24(D6) U8.25(D7) U9.5(B:+IN2) U9.6(B:-IN2) U9.7(B:OUT2) U11.3(NC)

## Notes on the sheet
- v1.0 | Changing CH340T into CP2102N | 2019/12/20 | Milo
- Input
- Level Translator
- The I2C slave address is 0x78.
  If the customer ties D/C# (pin 15) to VCC,
  the I2C slave address will be 0x7a
- Delay Reset
- Reduction Voltage
- Milo
- weifeng.zeng | Bruce | Zhanzhao.Fang
- For test
- weifeng.zeng | Luo Jianping | Bruce | wangcf | Bruce
- v1.4 | v1.6
- Xiangnan.Qu | Wangcf
- v1.2

## Library data of the parts
A0 A2 A6 J1 J7 J10 J11 = Connector :TWIG-4P-2.0
BUZ1 = discrete:BUZZER
C1 C2 C51-C53 = discrete:C*: Ceramic Capacitors
C3 C5-C7 C11-C41 C55 C58-C61 = Discrete-new:CAP: Ceramic Capacitors
C4 C8-C10 C56 C57 = C-R-package test:CAP: Ceramic Capacitors
C42-C50 = Discrete-small:C*: Ceramic Capacitors
C54 = CPT_SMD:C0603; C0603: 100N
D1 D8 D9 = Discrete-new:D-ESD-2P: SOD-923:304060009;SOD-123:304060001
D2-D7 I2C. I2C.. J9 UART = Connector:TWIG-4P-2.0
D10 RX TX = Discrete-new:LED
D11 = Discrete-new:DIODE
F1 = Discrete-new:FUSE
FR2-FR5 = moudle-new:SEEEDSTUDIO-OPEN-SCH-FRAME
GND GND2-GND4 NC1-NC6 OUT SIG1 SIG3 SIG4 SIG_I SIG_O TP1-TP4 TP18-TP21 VCC VCC2-VCC4 = discrete:PAD-TEST-POINT; PARTNO: DNP
GND1 NC SIG TP5-TP17 VCC1 = Discrete-new:TEST-POINT; PARTNO: DNP
INT = Connector:HEADER-1P
INTERFACE = Discrete-new:JUMPER-2P-SHORT
J3 = Connector-new:MICRO-USB5+4P: 5+4P-SMD-0.65-B:320010000;5+2P-SMD-0.65-AB:340032001;5+5P-SMD-0.65-7.2X5.06MM:320010050;
J4 J6 J12 = Connector-new:GROVE-CONNECTOR-DIP
J5 J8 = CONNECTER:TWIG_2.0
JP1 = Discrete-new:JP-3P-SHORT
L PWR RST = discrete:LED*
LIGHT = Discrete-new:PHOTISTOR-PT550
MIC1 = discrete:MICROPHONE
Q1-Q3 = discrete:MOSFET-N: IRLL014: http://www.vishay.com/docs/91319/sihll014.pdf
Q4 Q5 Q7 Q8 Q10 Q11 = Discrete-new:MOSFET-N
Q6 Q9 = discrete:TRANSISTOR-NPN*: NPN audion
R1-R3 R5 R10 R11 R15-R30 R32-R35 R45 R54 R59-R63 = Discrete-new:RES
R4 R6-R8 R46-R52 R56-R58 R64 = discrete:R*
R9 R12-R14 = C-R-package test:RES
R31 = Discrete-new:RES-ADJ: Potentiometer
R36-R44 = Discrete-small:R*
R53 = CPT_SMD:R0603
R55 = discrete:005-R*
RESET = discrete:BUTTON-4P-REINFORCE: TS-1188E http://www.best-dz.com/?thread-374-2.html
ROTATION = discrete:R-POTENTIOMETER*: Potentiometer
SW2 = Switch_jumpers:BTN
U1 = template:SENSOR-MOTION/POSITION-LIS3DH
U2 = IC:XC6206: LOW ESR Cap.Compatible Positive Voltage Regulators
U3 = IC:LD1117: Low Drop Fixed And Adjustable Positive Voltage Regulators http://www.datasheetcatalog.org/datasheet/SGSThomsonMicroelectronics/mXuqtqv.pdf
U4 = IC:ATMEGA8/168/328: MICROCONTROLLER
U5 = moudle:ARDUINO-38P
U6 = template:CONVERTER-CP2102N(QFN24)
U7 U13 = IC-new:PMIC-XC6206P: LOW ESR Cap.Compatible Positive Voltage Regulators
U8 = moudle-new:OLED-128*64-30P: 308020008
U9 = IC-new:AMPLIFIER-LMV358: SOIC-8:310020002;MSOP-8:310020007
U10 = IC:LMV358: General purpose LOW Voltage, Rail-to-Rail Output Amplifiers http://www.fairchildsemi.com/ds/LM/LMV358.pdf
U11 = discrete:SENSOR-DHT11
U12 = template:SENSOR-BMP280: Digital Pressure Sensor; MPN: BMP280
X1 = Discrete-new:CRYSTAL-4P

## Net classes
0 default: width 0.152 mm, clearance 0.152 mm